# Altium schematic sheet ESP32_FINAL.SchDoc
size A4; SheetNumber: 1; SheetTotal: 1
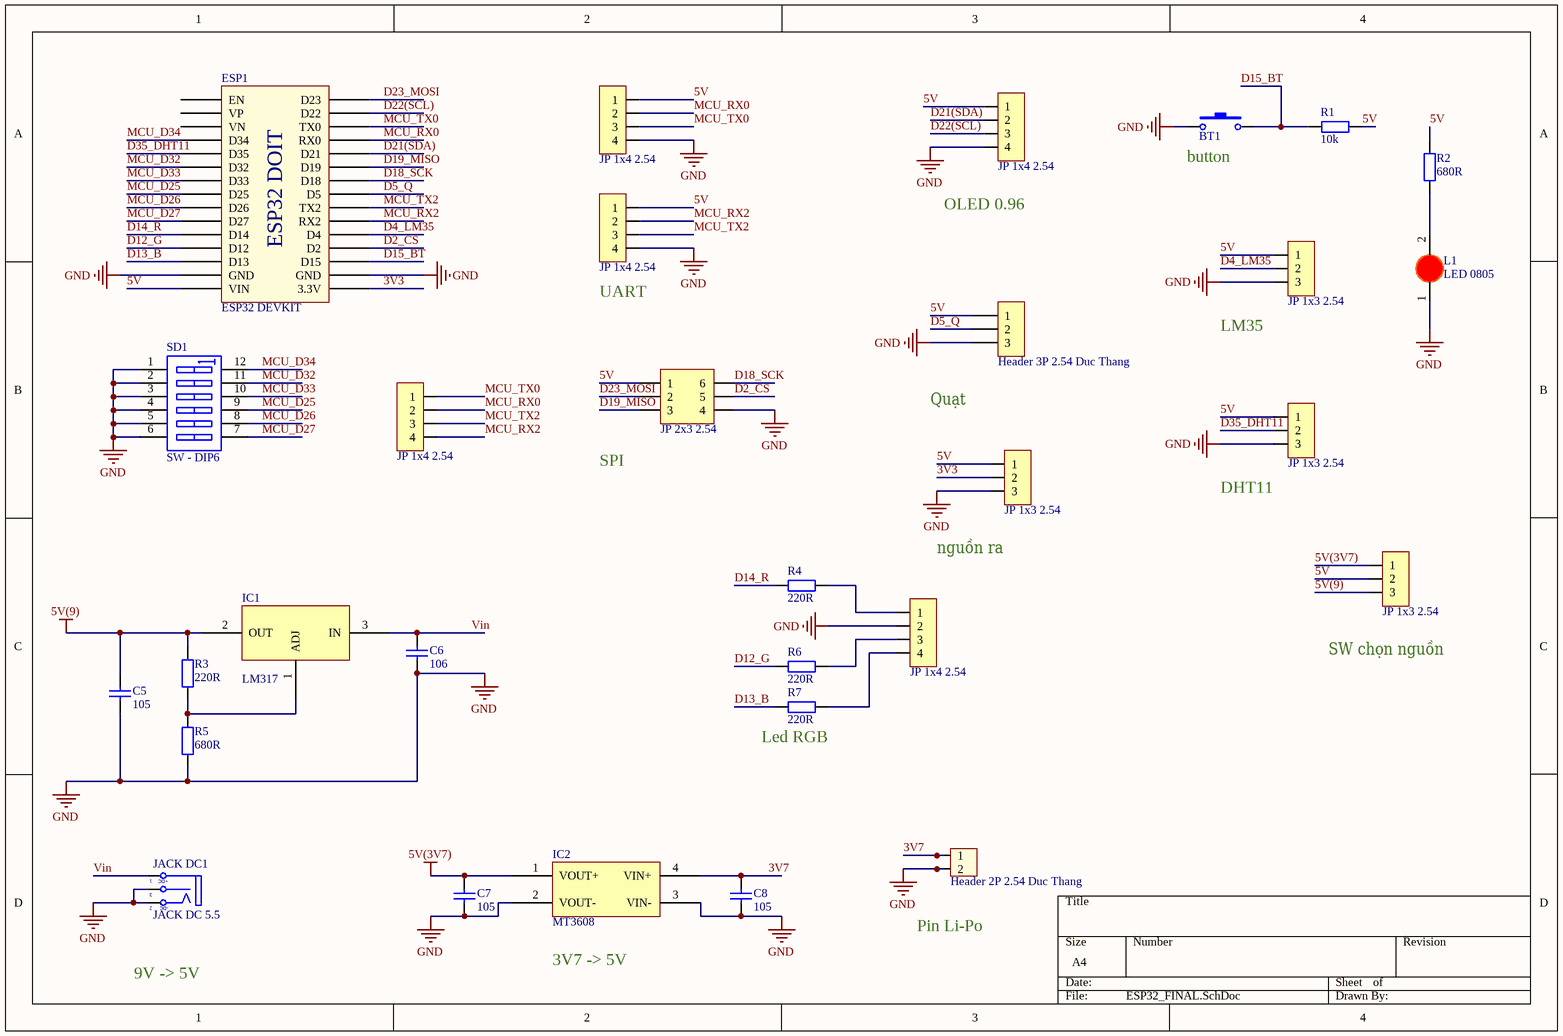
[diagram p0: ESP32_FINAL.SchDoc]

## Parts
BT1  Nut Nhan 2 Chan SMD 3x6x2.5  [Nut Nhan 2 Chan SMD 3x6x2.5]  (value not drawn)
C5  105  [tu 0805]
C6  106  [tu 0805]
C7  105  [tu 0805]
C8  105  [tu 0805]
ESP1  ESP32 DEVKIT  [ESP32 WROOM 32 KIT]
H1  Header 3P 2.54 Duc Thang  [XH2.54M-3]
H2  Header 2P 2.54 Duc Thang  [XH2.54M-2]
IC1  LM317  [SOT223]
IC2  MT3608  [MT3608 - duplicate3]
JACK_DC1  JACK DC 5.5  [JACK DC 5.5]
JP1  JP 1x4 2.54  [JP 1x4 CT]
JP2  JP 1x4 2.54  [JP 1x4 CT]
JP3  JP 1x4 2.54  [JP 1x4 CT]
JP4  JP 1x3 2.54  [JP 1x3 CT]
JP5  JP 2x3 2.54  [JP 2x3 CT]
JP6  JP 1x4 2.54  [JP 1x4 CT]
JP7  JP 1x3 2.54  [JP 1x3 CT]
JP8  JP 1x3 2.54  [JP 1x3 DT]
JP9  JP 1x4 2.54  [JP 1x4 CT]
JP10  JP 1x3 2.54  [JP 1x3 CT]
L1  LED 0805  [LED-0805-Red]
R1  10k  [tro smd 0805]
R2  680R  [Tro SMD 0805]
R3  220R  [tro smd 0805]
R4  220R  [tro smd 0805]
R5  680R  [Tro SMD 0805]
R6  220R  [tro smd 0805]
R7  220R  [tro smd 0805]
SD1  SW - DIP6  [DIP12/W0.3K]

## Nets
5V(3V7): C7.1 IC2.1(VOUT+) JP8.1
5V(9): C5.1 IC1.2(OUT) JP8.3 R3.2
GND: BT1.1 C5.2 C6.1 C7.2 C8.2 ESP1.14(GND) ESP1.17(GND) H1.3 H2.2 IC2.2(VOUT-) IC2.3(VIN-) JACK_DC1.2(TN) JACK_DC1.3(S) JP1.4 JP2.4 JP3.4 JP4.3 JP5.4 JP7.3 JP9.2 JP10.3 L1.1(A) R5.1 SD1.1(A1) SD1.2(A2) SD1.3(A3) SD1.4(A4) SD1.5(A5) SD1.6(A6)
3V3: ESP1.16(3.3V) JP10.2
3V7: C8.1 H2.1 IC2.4(VIN+)
5V: ESP1.15(VIN) H1.1 JP1.1 JP2.1 JP3.1 JP4.1 JP5.1 JP7.1 JP8.2 JP10.1 R1.2 R2.1
D2_CS: ESP1.19(D2) JP5.5
D4_LM35: ESP1.20(D4) JP4.2
D5_Q: ESP1.23(D5) H1.2
D12_G: ESP1.12(D12) R6.1
D13_B: ESP1.13(D13) R7.1
D14_R: ESP1.11(D14) R4.1
D15_BT: BT1.2 ESP1.18(D15) R1.1
D18_SCK: ESP1.24(D18) JP5.6
D19_MISO: ESP1.25(D19) JP5.3
D21(SDA): ESP1.26(D21) JP2.2
D22(SCL): ESP1.29(D22) JP2.3
D23_MOSI: ESP1.30(D23) JP5.2
D35_DHT11: ESP1.5(D35) JP7.2
MCU_D25: ESP1.8(D25) SD1.9(B8)
MCU_D26: ESP1.9(D26) SD1.8(A8)
MCU_D27: ESP1.10(D27) SD1.7(A7)
MCU_D32: ESP1.6(D32) SD1.11(B6)
MCU_D33: ESP1.7(D33) SD1.10(B7)
MCU_D34: ESP1.4(D34) SD1.12(B5)
MCU_RX0: ESP1.27(RX0) JP1.2 JP6.2
MCU_RX2: ESP1.21(RX2) JP3.2 JP6.4
MCU_TX0: ESP1.28(TX0) JP1.3 JP6.1
MCU_TX2: ESP1.22(TX2) JP3.3 JP6.3
Vin: C6.2 IC1.3(IN) JACK_DC1.1(T)
NetIC1_1: IC1.1(ADJ) R3.1 R5.2
NetJP9_1: JP9.1 R4.2
NetJP9_3: JP9.3 R6.2
NetJP9_4: JP9.4 R7.2
NetL1_2: L1.2(K) R2.2

Not connected (* = marked no-connect by the designer): ESP1 1(EN) 2(VP) 3(VN)

## Notes on the sheet
- (near BT1) button
- (near JP2) OLED 0.96
- (near JP3) UART
- (near JP4) LM35
- Quạt
- SPI
- (near JP7) DHT11
- nguồn ra
- (near JP8) SW chọn nguồn
- (near R7) Led RGB
- 9V -> 5V
- (near IC2) 3V7 -> 5V
- (near H2) Pin Li-Po
- (in symbol ESP32 WROOM 32 KIT) ESP32 DOIT
- (in symbol JACK DC 5.5) +DC; -DC

## Library data of the parts
BT1 = Nut Nhan 2 Chan SMD 3x6x2.5: Ma_Hang: MH001036; Ten: Nút Nhấn 2 Chân 3x6x2.5MM SMD
C5 C7 C8 = Tu 0805 105 50V 10%: Dán; Don_Vi: Con; So_Chan: 2; Ten_Linh_Kien: Tụ 0805 105-1uF 10% 50V; Ma_Hang: MH004552; Chung_Loai: Dán; Kieu_Chan: *
C6 = Tu 0805 106 16V 10%: Dán; Ten_Linh_Kien: Tụ 0805 106-10uF 10% 16V; So_Chan: 2; Don_Vi: Con; Ma_Hang: MH004553; Chung_Loai: Dán; Kieu_Chan: *
ESP1 = ESP32 WROOM 32 KIT
H1 = Header 3P 2.54 Duc Thang: Cắm; Ten_Linh_Kien: Header 3P XH2.54-3P Đực Thẳng; Don_Vi: Con; Ma_Hang: MH001292; Chung_Loai: Cắm
H2 = Header 2P 2.54 Duc Thang: Cắm; Ten_Linh_Kien: Header 2P XH2.54-2P Đực Thẳng; Don_Vi: Con; Ma_Hang: MH001283; Chung_Loai: Cắm
IC1 = LM317 TO223 SMD: Dán; Ten_Linh_Kien: LM317 TO223 ADJ 0.5A (N07A,N01A); Ma_Hang: MH003617; Don_Vi: Con; Kieu_Chan: *; Ghi_Chu: *; Chung_Loai: Dán
IC2 = MT3608_V2: 2A DC-DC BOOST; ComponentLink1Description: New link; ComponentLink1URL: *
JACK_DC1 = JACK DC 5.5: Value: Jac DC
JP1-JP3 JP6 JP9 = JP 1x4 2.54 Cai Thang: Cắm; Ten_Linh_Kien: Jump Đơn Cái 2.54MM 1x20P Thẳng; Don_Vi: Con; Ma_Hang: MH004006; Ghi_Chu: *; Kieu_Chan: *; Chung_Loai: Cắm
JP4 JP7 JP10 = JP 1x3 2.54 Cai Thang: Cắm; Ten_Linh_Kien: Jump Đơn Cái 2.54MM 1x20P Thẳng; Don_Vi: Con; Ma_Hang: MH004006; Ghi_Chu: *; Kieu_Chan: *; Chung_Loai: Cắm
JP5 = JP 2x3 2.54 Cai Thang: Cắm; Ten_Linh_Kien: Jump Đôi Cái 2.54MM 2x20P Thẳng; Don_Vi: Con; Ma_Hang: MH008647; Ghi_Chu: *; Kieu_Chan: *; Chung_Loai: Cắm
JP8 = JP 1x3 2.54 Duc Thang: Cắm; Ten_Linh_Kien: Jump Đơn Đực 2.54MM 1x40P Thẳng 11MM; Don_Vi: Con; Ma_Hang: MH000903; Ghi_Chu: *; Kieu_Chan: *; Chung_Loai: Cắm
L1 = LED 0805 Do: Dán; Don_Vi: Con; Ma_Hang: MH000897; Ten_Linh_Kien: LED 0805 Màu Đỏ (Red); Ghi_Chu: *; Kieu_Chan: *; Chung_Loai: Dán
R1 = Tro 0805 1% 10k: Dán; Don_Vi: Con; So_Chan: 2; Ten_Linh_Kien: Trở 0805 1% 10k; Ma_Hang: MH005473; Chung_Loai: Dán; Kieu_Chan: *
R2 R5 = Tro 0805 5% 680R: Dán; Don_Vi: Con; Ma_Hang: MH005344; So_Chan: 2; Ten_Linh_Kien: Trở 0805 5% 680R; Chung_Loai: Dán; Kieu_Chan: *
R3 R4 R6 R7 = Tro 0805 5% 220R: Dán; Don_Vi: Con; So_Chan: 2; Ten_Linh_Kien: Trở 0805 5% 220R; Ma_Hang: MH005259; Chung_Loai: Dán; Kieu_Chan: *
SD1 = SWDIP-6: DIP Switch, 6 Position, SPST; Value: SW - DIP8